# EAGLE design FlipDotModule (EAGLE 9.1.3)
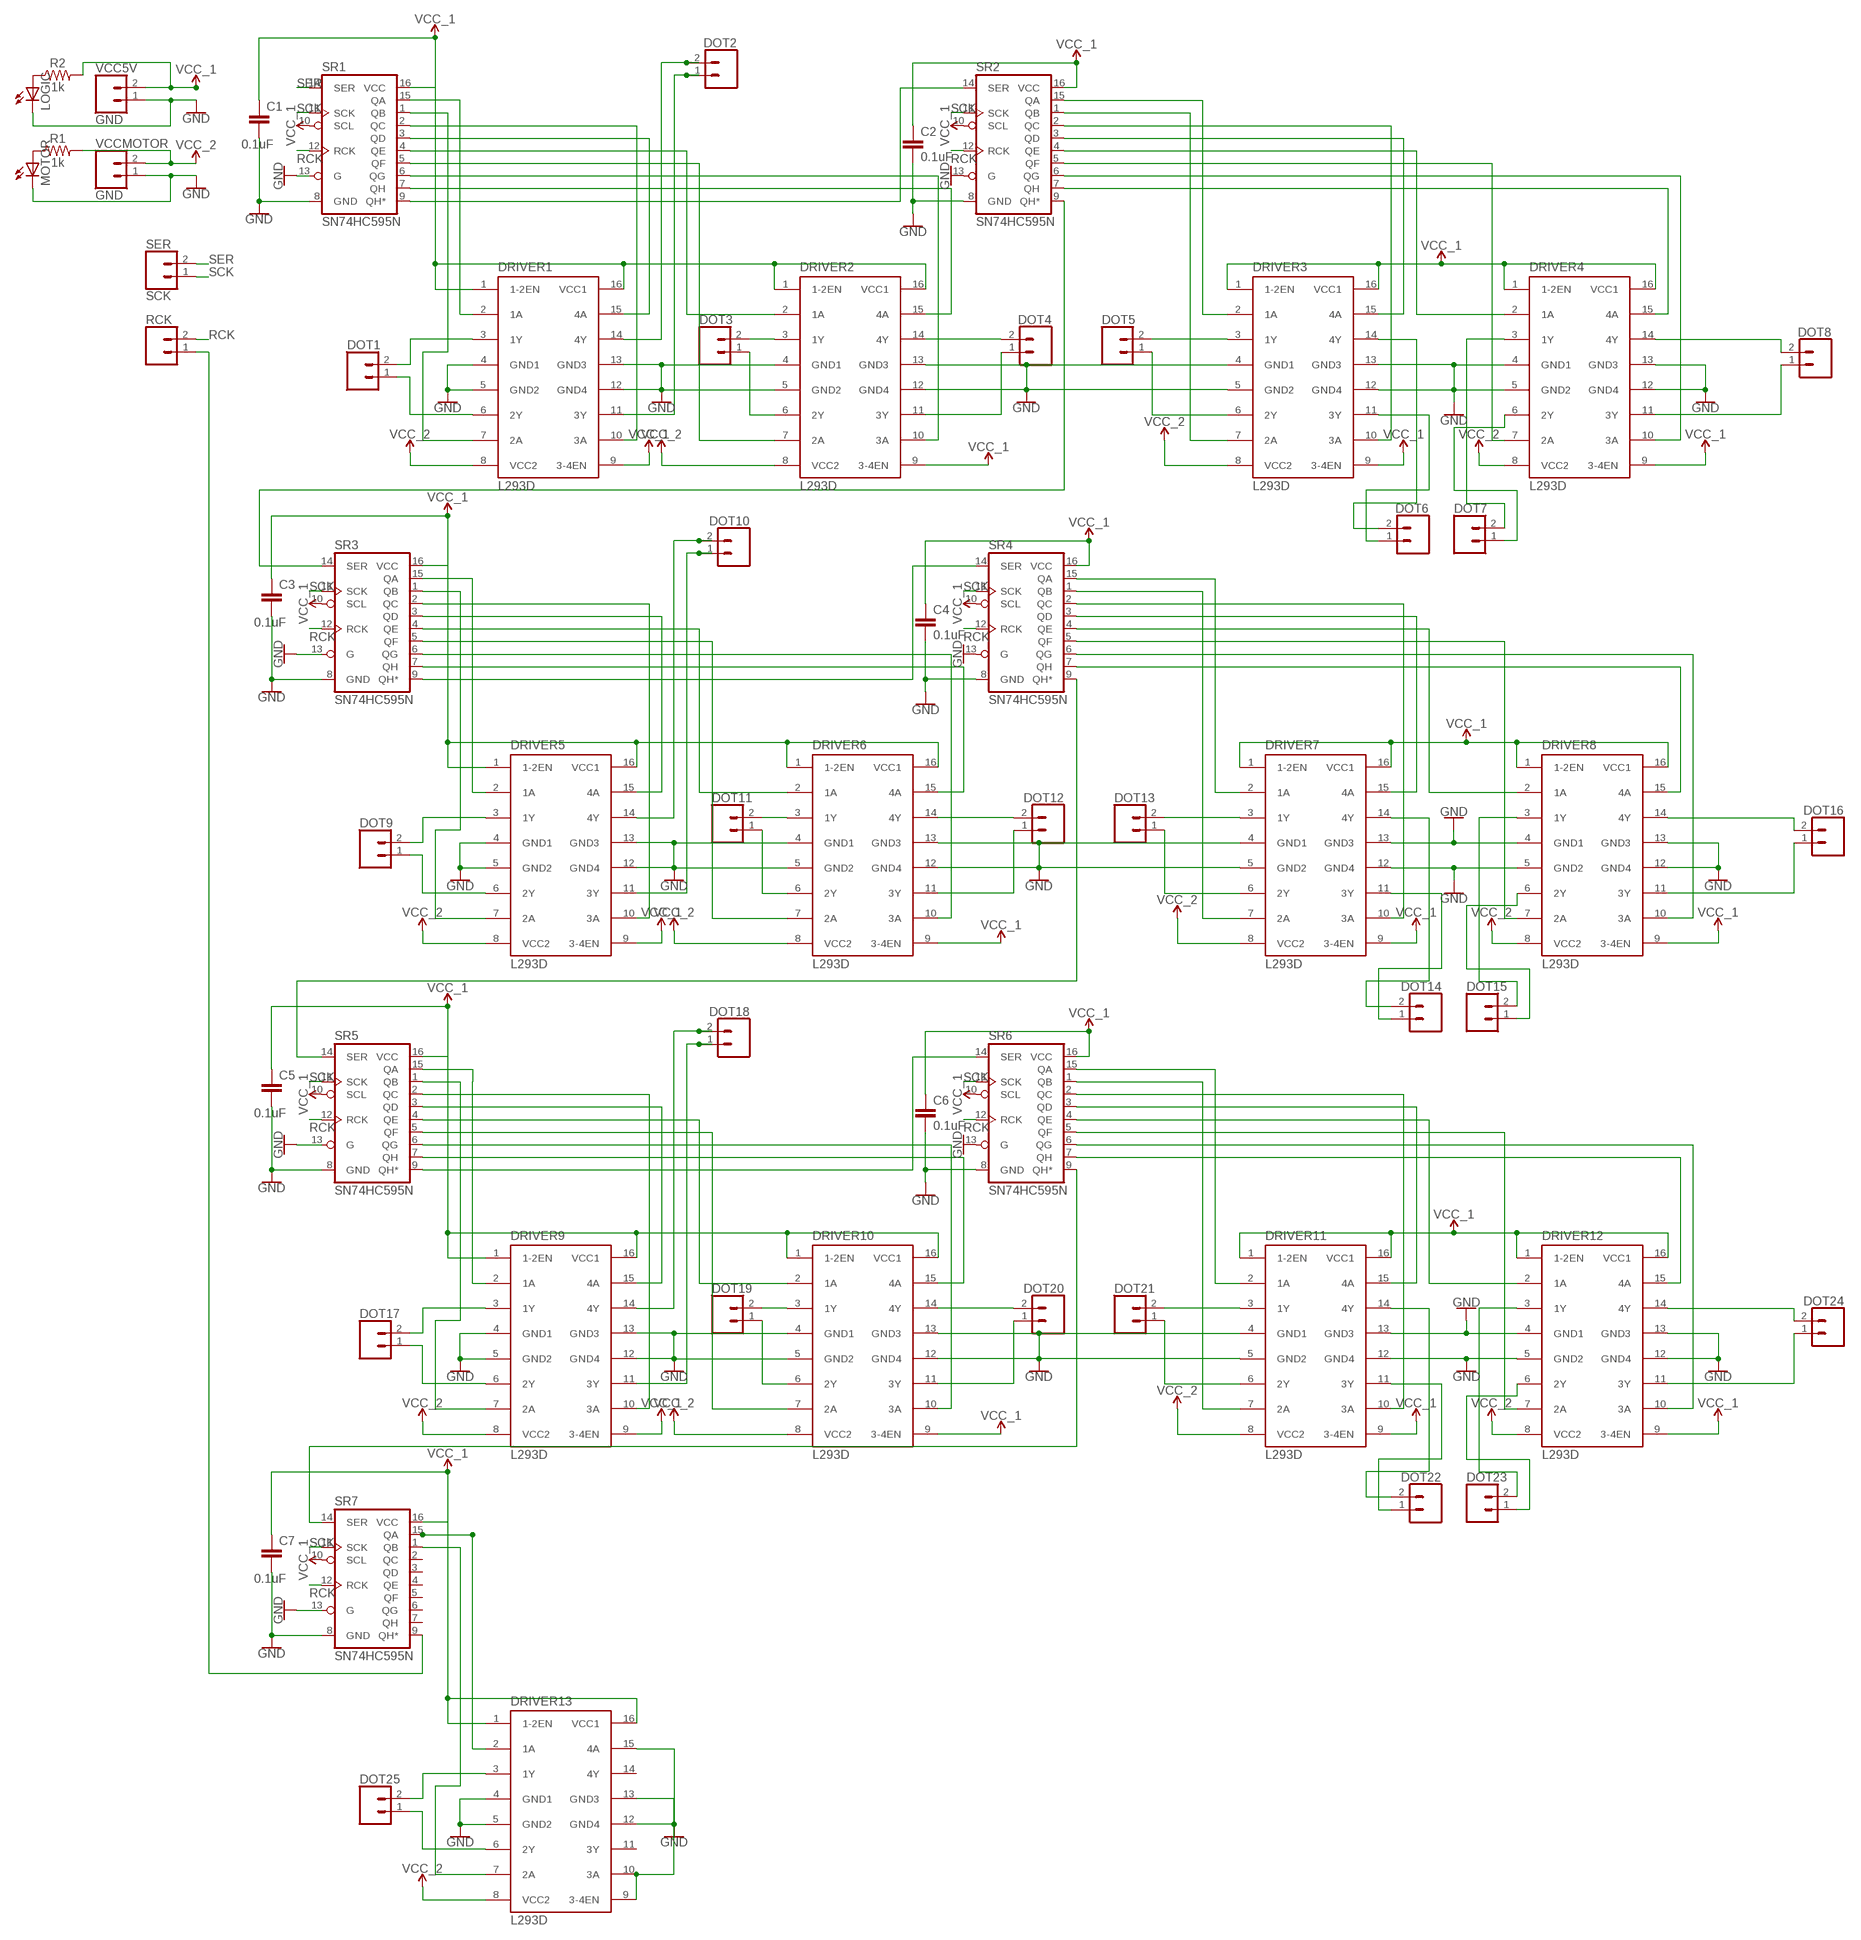
[diagram p0: schematic, sheet 1, part 1 of 2]
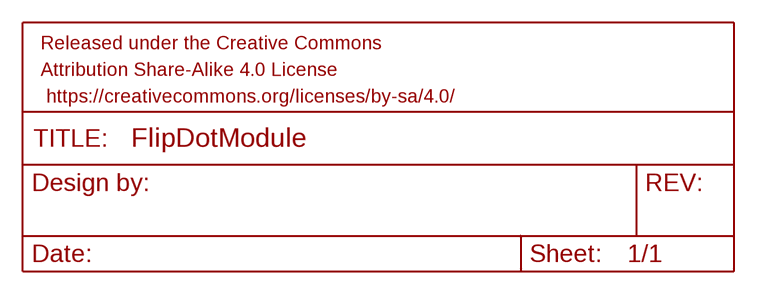
[diagram p1: schematic, sheet 1, part 2 of 2]

## Parts
C1  0.1uF  0.1UF-KIT-EZ-50V-20%  [CAP-PTH-SMALL-KIT]
C2  0.1uF  0.1UF-KIT-EZ-50V-20%  [CAP-PTH-SMALL-KIT]
C3  0.1uF  0.1UF-KIT-EZ-50V-20%  [CAP-PTH-SMALL-KIT]
C4  0.1uF  0.1UF-KIT-EZ-50V-20%  [CAP-PTH-SMALL-KIT]
C5  0.1uF  0.1UF-KIT-EZ-50V-20%  [CAP-PTH-SMALL-KIT]
C6  0.1uF  0.1UF-KIT-EZ-50V-20%  [CAP-PTH-SMALL-KIT]
C7  0.1uF  0.1UF-KIT-EZ-50V-20%  [CAP-PTH-SMALL-KIT]
DOT1  CONN_025MM  [SCREWTERMINAL-5MM-2]
DOT2  CONN_025MM  [SCREWTERMINAL-5MM-2]
DOT3  CONN_025MM  [SCREWTERMINAL-5MM-2]
DOT4  CONN_025MM  [SCREWTERMINAL-5MM-2]
DOT5  CONN_025MM  [SCREWTERMINAL-5MM-2]
DOT6  CONN_025MM  [SCREWTERMINAL-5MM-2]
DOT7  CONN_025MM  [SCREWTERMINAL-5MM-2]
DOT8  CONN_025MM  [SCREWTERMINAL-5MM-2]
DOT9  CONN_025MM  [SCREWTERMINAL-5MM-2]
DOT10  CONN_025MM  [SCREWTERMINAL-5MM-2]
DOT11  CONN_025MM  [SCREWTERMINAL-5MM-2]
DOT12  CONN_025MM  [SCREWTERMINAL-5MM-2]
DOT13  CONN_025MM  [SCREWTERMINAL-5MM-2]
DOT14  CONN_025MM  [SCREWTERMINAL-5MM-2]
DOT15  CONN_025MM  [SCREWTERMINAL-5MM-2]
DOT16  CONN_025MM  [SCREWTERMINAL-5MM-2]
DOT17  CONN_025MM  [SCREWTERMINAL-5MM-2]
DOT18  CONN_025MM  [SCREWTERMINAL-5MM-2]
DOT19  CONN_025MM  [SCREWTERMINAL-5MM-2]
DOT20  CONN_025MM  [SCREWTERMINAL-5MM-2]
DOT21  CONN_025MM  [SCREWTERMINAL-5MM-2]
DOT22  CONN_025MM  [SCREWTERMINAL-5MM-2]
DOT23  CONN_025MM  [SCREWTERMINAL-5MM-2]
DOT24  CONN_025MM  [SCREWTERMINAL-5MM-2]
DOT25  CONN_025MM  [SCREWTERMINAL-5MM-2]
DRIVER1  L293D  [DIL16]
DRIVER2  L293D  [DIL16]
DRIVER3  L293D  [DIL16]
DRIVER4  L293D  [DIL16]
DRIVER5  L293D  [DIL16]
DRIVER6  L293D  [DIL16]
DRIVER7  L293D  [DIL16]
DRIVER8  L293D  [DIL16]
DRIVER9  L293D  [DIL16]
DRIVER10  L293D  [DIL16]
DRIVER11  L293D  [DIL16]
DRIVER12  L293D  [DIL16]
DRIVER13  L293D  [DIL16]
FRAME1  FRAME-LETTERNO_PACKAGE  [DUMMY]
LOGIC  LED3MM  [LED3MM]
MOTOR  LED3MM  [LED3MM]
R1  1k  1KOHM-HORIZ-1/4W-5%  [AXIAL-0.3]
R2  1k  1KOHM-HORIZ-1/4W-5%  [AXIAL-0.3]
RCK  CONN_025MM  [SCREWTERMINAL-5MM-2]
SER  SCK  CONN_025MM  [SCREWTERMINAL-5MM-2]
SR1  SN74HC595N  74HC595N  [DIP16]
SR2  SN74HC595N  74HC595N  [DIP16]
SR3  SN74HC595N  74HC595N  [DIP16]
SR4  SN74HC595N  74HC595N  [DIP16]
SR5  SN74HC595N  74HC595N  [DIP16]
SR6  SN74HC595N  74HC595N  [DIP16]
SR7  SN74HC595N  74HC595N  [DIP16]
VCC5V  GND  CONN_025MM  [SCREWTERMINAL-5MM-2]
VCCMOTOR  GND  CONN_025MM  [SCREWTERMINAL-5MM-2]

## Nets
GND [GND]: C1.2 C2.2 C3.2 C4.2 C5.2 C6.2 C7.2 DRIVER1.4(GND1) DRIVER1.5(GND2) DRIVER1.12(GND4) DRIVER1.13(GND3) DRIVER2.4(GND1) DRIVER2.5(GND2) DRIVER2.12(GND4) DRIVER2.13(GND3) DRIVER3.4(GND1) DRIVER3.5(GND2) DRIVER3.12(GND4) DRIVER3.13(GND3) DRIVER4.4(GND1) DRIVER4.5(GND2) DRIVER4.12(GND4) DRIVER4.13(GND3) DRIVER5.4(GND1) DRIVER5.5(GND2) DRIVER5.12(GND4) DRIVER5.13(GND3) DRIVER6.4(GND1) DRIVER6.5(GND2) DRIVER6.12(GND4) DRIVER6.13(GND3) DRIVER7.4(GND1) DRIVER7.5(GND2) DRIVER7.12(GND4) DRIVER7.13(GND3) DRIVER8.4(GND1) DRIVER8.5(GND2) DRIVER8.12(GND4) DRIVER8.13(GND3) DRIVER9.4(GND1) DRIVER9.5(GND2) DRIVER9.12(GND4) DRIVER9.13(GND3) DRIVER10.4(GND1) DRIVER10.5(GND2) DRIVER10.12(GND4) DRIVER10.13(GND3) DRIVER11.4(GND1) DRIVER11.5(GND2) DRIVER11.12(GND4) DRIVER11.13(GND3) DRIVER12.4(GND1) DRIVER12.5(GND2) DRIVER12.12(GND4) DRIVER12.13(GND3) DRIVER13.4(GND1) DRIVER13.5(GND2) DRIVER13.9(3-4EN) DRIVER13.10(3A) DRIVER13.12(GND4) DRIVER13.13(GND3) DRIVER13.15(4A) LOGIC.K(C) MOTOR.K(C) SR1.8(GND) SR1.13(G) SR2.8(GND) SR2.13(G) SR3.8(GND) SR3.13(G) SR4.8(GND) SR4.13(G) SR5.8(GND) SR5.13(G) SR6.8(GND) SR6.13(G) SR7.8(GND) SR7.13(G) VCC5V.1 VCCMOTOR.1
N$1: SR1.9(QH*) SR2.14(SER)
N$2: DOT5.2 DRIVER3.3(1Y)
N$3: MOTOR.A R1.P$1
N$5: DRIVER1.7(2A) SR1.1(QB)
N$6: SR3.9(QH*) SR4.14(SER)
N$7: LOGIC.A R2.P$1
N$8: DRIVER1.10(3A) SR1.2(QC)
N$9: DRIVER1.15(4A) SR1.3(QD)
N$10: DRIVER2.2(1A) SR1.4(QE)
N$11: DRIVER2.7(2A) SR1.5(QF)
N$12: DRIVER2.10(3A) SR1.6(QG)
N$13: DRIVER2.15(4A) SR1.7(QH)
N$14: DRIVER1.2(1A) SR1.15(QA)
N$16: DRIVER5.7(2A) SR3.1(QB)
N$18: DRIVER3.2(1A) SR2.15(QA)
N$19: DRIVER3.7(2A) SR2.1(QB)
N$20: DRIVER3.10(3A) SR2.2(QC)
N$21: DRIVER3.15(4A) SR2.3(QD)
N$22: DRIVER4.2(1A) SR2.4(QE)
N$23: DRIVER4.7(2A) SR2.5(QF)
N$24: DRIVER4.10(3A) SR2.6(QG)
N$25: DRIVER4.15(4A) SR2.7(QH)
N$26: DOT1.2 DRIVER1.3(1Y)
N$27: DOT4.2 DRIVER2.14(4Y)
N$28: DOT2.1 DRIVER1.11(3Y)
N$29: DOT1.1 DRIVER1.6(2Y)
N$30: DOT3.2 DRIVER2.3(1Y)
N$31: DOT3.1 DRIVER2.6(2Y)
N$32: DOT2.2 DRIVER1.14(4Y)
N$33: DOT4.1 DRIVER2.11(3Y)
N$34: DOT5.1 DRIVER3.6(2Y)
N$35: DOT6.2 DRIVER3.14(4Y)
N$36: DOT6.1 DRIVER3.11(3Y)
N$37: DOT7.2 DRIVER4.3(1Y)
N$38: DOT7.1 DRIVER4.6(2Y)
N$39: DOT8.2 DRIVER4.14(4Y)
N$40: DOT8.1 DRIVER4.11(3Y)
N$41: DRIVER5.10(3A) SR3.2(QC)
N$42: DRIVER5.15(4A) SR3.3(QD)
N$43: DRIVER6.2(1A) SR3.4(QE)
N$44: DRIVER6.7(2A) SR3.5(QF)
N$45: DRIVER6.10(3A) SR3.6(QG)
N$46: DRIVER6.15(4A) SR3.7(QH)
N$47: DRIVER5.2(1A) SR3.15(QA)
N$49: DRIVER7.2(1A) SR4.15(QA)
N$50: DRIVER7.7(2A) SR4.1(QB)
N$51: DRIVER7.10(3A) SR4.2(QC)
N$52: DRIVER7.15(4A) SR4.3(QD)
N$53: DRIVER8.2(1A) SR4.4(QE)
N$54: DRIVER8.7(2A) SR4.5(QF)
N$55: DRIVER8.10(3A) SR4.6(QG)
N$56: DRIVER8.15(4A) SR4.7(QH)
N$57: DOT10.1 DRIVER5.11(3Y)
N$58: DOT9.2 DRIVER5.3(1Y)
N$59: DOT9.1 DRIVER5.6(2Y)
N$60: DOT11.2 DRIVER6.3(1Y)
N$61: DOT11.1 DRIVER6.6(2Y)
N$62: DOT10.2 DRIVER5.14(4Y)
N$63: DOT12.2 DRIVER6.14(4Y)
N$64: DOT12.1 DRIVER6.11(3Y)
N$65: DOT13.2 DRIVER7.3(1Y)
N$66: DOT13.1 DRIVER7.6(2Y)
N$67: DOT14.2 DRIVER7.14(4Y)
N$68: DOT14.1 DRIVER7.11(3Y)
N$69: DOT15.2 DRIVER8.3(1Y)
N$70: DOT15.1 DRIVER8.6(2Y)
N$71: DOT16.2 DRIVER8.14(4Y)
N$72: DOT16.1 DRIVER8.11(3Y)
N$73: SR5.9(QH*) SR6.14(SER)
N$75: DRIVER9.2(1A) SR5.15(QA)
N$76: DRIVER9.7(2A) SR5.1(QB)
N$77: DRIVER9.10(3A) SR5.2(QC)
N$78: DRIVER9.15(4A) SR5.3(QD)
N$79: DRIVER10.2(1A) SR5.4(QE)
N$80: DRIVER10.7(2A) SR5.5(QF)
N$81: DRIVER10.10(3A) SR5.6(QG)
N$82: DRIVER10.15(4A) SR5.7(QH)
N$85: DRIVER11.2(1A) SR6.15(QA)
N$86: DRIVER11.7(2A) SR6.1(QB)
N$87: DRIVER11.10(3A) SR6.2(QC)
N$88: DRIVER11.15(4A) SR6.3(QD)
N$89: DRIVER12.2(1A) SR6.4(QE)
N$90: DRIVER12.7(2A) SR6.5(QF)
N$91: DRIVER12.10(3A) SR6.6(QG)
N$92: DRIVER12.15(4A) SR6.7(QH)
N$93: DOT18.1 DRIVER9.11(3Y)
N$94: DOT17.2 DRIVER9.3(1Y)
N$95: DOT17.1 DRIVER9.6(2Y)
N$96: DOT19.2 DRIVER10.3(1Y)
N$97: DOT19.1 DRIVER10.6(2Y)
N$98: DOT18.2 DRIVER9.14(4Y)
N$99: DOT20.2 DRIVER10.14(4Y)
N$100: DOT20.1 DRIVER10.11(3Y)
N$101: DOT21.2 DRIVER11.3(1Y)
N$102: DOT21.1 DRIVER11.6(2Y)
N$103: DOT22.2 DRIVER11.14(4Y)
N$104: DOT22.1 DRIVER11.11(3Y)
N$105: DOT23.2 DRIVER12.3(1Y)
N$106: DOT23.1 DRIVER12.6(2Y)
N$107: DOT24.2 DRIVER12.14(4Y)
N$108: DOT24.1 DRIVER12.11(3Y)
N$109: RCK.1 SR7.9(QH*)
N$111: DRIVER13.2(1A) SR7.15(QA)
N$112: DRIVER13.7(2A) SR7.1(QB)
N$130: DOT25.2 DRIVER13.3(1Y)
N$131: DOT25.1 DRIVER13.6(2Y)
N$145: SR2.9(QH*) SR3.14(SER)
N$146: SR4.9(QH*) SR5.14(SER)
N$147: SR6.9(QH*) SR7.14(SER)
RCK: RCK.2 SR1.12(RCK) SR2.12(RCK) SR3.12(RCK) SR4.12(RCK) SR5.12(RCK) SR6.12(RCK) SR7.12(RCK)
SCK: SER.1 SR1.11(SCK) SR2.11(SCK) SR3.11(SCK) SR4.11(SCK) SR5.11(SCK) SR6.11(SCK) SR7.11(SCK)
SER: SER.2 SR1.14(SER)
VCC_1 [GND]: C1.1 C2.1 C3.1 C4.1 C5.1 C6.1 C7.1 DRIVER1.1(1-2EN) DRIVER1.9(3-4EN) DRIVER1.16(VCC1) DRIVER2.1(1-2EN) DRIVER2.9(3-4EN) DRIVER2.16(VCC1) DRIVER3.1(1-2EN) DRIVER3.9(3-4EN) DRIVER3.16(VCC1) DRIVER4.1(1-2EN) DRIVER4.9(3-4EN) DRIVER4.16(VCC1) DRIVER5.1(1-2EN) DRIVER5.9(3-4EN) DRIVER5.16(VCC1) DRIVER6.1(1-2EN) DRIVER6.9(3-4EN) DRIVER6.16(VCC1) DRIVER7.1(1-2EN) DRIVER7.9(3-4EN) DRIVER7.16(VCC1) DRIVER8.1(1-2EN) DRIVER8.9(3-4EN) DRIVER8.16(VCC1) DRIVER9.1(1-2EN) DRIVER9.9(3-4EN) DRIVER9.16(VCC1) DRIVER10.1(1-2EN) DRIVER10.9(3-4EN) DRIVER10.16(VCC1) DRIVER11.1(1-2EN) DRIVER11.9(3-4EN) DRIVER11.16(VCC1) DRIVER12.1(1-2EN) DRIVER12.9(3-4EN) DRIVER12.16(VCC1) DRIVER13.1(1-2EN) DRIVER13.16(VCC1) R2.P$2 SR1.10(SCL) SR1.16(VCC) SR2.10(SCL) SR2.16(VCC) SR3.10(SCL) SR3.16(VCC) SR4.10(SCL) SR4.16(VCC) SR5.10(SCL) SR5.16(VCC) SR6.10(SCL) SR6.16(VCC) SR7.10(SCL) SR7.16(VCC) VCC5V.2
VCC_2 [VCC_2]: DRIVER1.8(VCC2) DRIVER2.8(VCC2) DRIVER3.8(VCC2) DRIVER4.8(VCC2) DRIVER5.8(VCC2) DRIVER6.8(VCC2) DRIVER7.8(VCC2) DRIVER8.8(VCC2) DRIVER9.8(VCC2) DRIVER10.8(VCC2) DRIVER11.8(VCC2) DRIVER12.8(VCC2) DRIVER13.8(VCC2) R1.P$2 VCCMOTOR.2
Unconnected: DRIVER13.11(3Y) DRIVER13.14(4Y) SR7.2(QC) SR7.3(QD) SR7.4(QE) SR7.5(QF) SR7.6(QG) SR7.7(QH)

## Library data of the parts
C1-C7 = SparkFun-Capacitors:0.1UF: 0.1µF ceramic capacitors A capacitor is a passive two-terminal electrical component used to store electrical energy temporarily in an electric field.; PROD_ID: CAP-08370
DOT1-DOT25 RCK SER VCC5V VCCMOTOR = SparkFun-Connectors:CONN_02: Multi connection point. Often used as Generic Header-pin footprint for 0.1 inch spaced/style header connections On any of the 0.1 inch spaced packages, you can populate with these: Break Away Headers - Straight <https://www.sparkfun.com/products/116> (PRT-00116) Break Away Male Headers - Right Angle <https://www.sparkfun.com/products/553> (PRT-00553) Female Headers <https://www.sparkfun.com/products/115> (PRT-00115) Break Away Headers - Machine Pin <https://www.sparkfun.com/products/117> (PRT-00117) Break Away Female Headers - Swiss Machine Pin <https://www.sparkfun.com/products/743> (PRT-00743) For SCREWTERMINALS and SPRING TERMINALS visit here: Screw Terimnals on SparkFun.com <https://www.sparkfun.com/search/results?term=Screw+Terminals> (5mm/3.5mm/2.54mm spacing) This device is also useful as a general connection point to wire up your design to another part of your project. Our various solder wires solder well into these plated through hole pads. Hook-Up Wire - Assortment (Stranded, 22 AWG) <https://www.sparkfun.com/products/11375> (PRT-11375) Hook-Up Wire - Assortment (Solid Core, 22 AWG) <https://www.sparkfun.com/products/11367> (PRT-11367) View the entire wire category on our website here <https://www.sparkfun.com/categories/141> Special notes: Molex polarized connector foot print use with: PRT-08233 with associated crimp pins and housings. 2.54_SCREWTERM for use with PRT-10571. 3.5mm Screw Terminal footprints for PRT-08084 5mm Screw Terminal footprints for use with PRT-08432; SF_SKU: PRT-08432
DRIVER1-DRIVER13 = st-microelectronics:L293D: PUSH-PULL 4 CHANNEL DRIVER; MPN: L293D; OC_FARNELL: 9589619; OC_NEWARK: 56P8249
FRAME1 = SparkFun-Aesthetics:FRAME-LETTER: Schematic Frame - Letter Standard 8.5x11 US Letter frame; DESIGNER: Nobody; VERSION: v01
LOGIC MOTOR = led:LED: LED OSRAM: - CHIPLED LG R971, LG N971, LY N971, LG Q971, LY Q971, LO R971, LY R971 LH N974, LH R974 LS Q976, LO Q976, LY Q976 LO Q996 - Hyper CHIPLED LW Q18S LB Q993, LB Q99A, LB R99A - SideLED LS A670, LO A670, LY A670, LG A670, LP A670 LB A673, LV A673, LT A673, LW A673 LH A674 LY A675 LS A676, LA A676, LO A676, LY A676, LW A676 LS A679, LY A679, LG A679 - Hyper Micro SIDELED® LS Y876, LA Y876, LO Y876, LY Y876 LT Y87S - SmartLED LW L88C, LW L88S LB L89C, LB L89S, LG L890 LS L89K, LO L89K, LY L89K LS L896, LA L896, LO L896, LY L896 - TOPLED LS T670, LO T670, LY T670, LG T670, LP T670 LSG T670, LSP T670, LSY T670, LOP T670, LYG T670 LG T671, LOG T671, LSG T671 LB T673, LV T673, LT T673, LW T673 LH T674 LS T676, LA T676, LO T676, LY T676, LB T676, LH T676, LSB T676, LW T676 LB T67C, LV T67C, LT T67C, LS T67K, LO T67K, LY T67K, LW E67C LS E67B, LA E67B, LO E67B, LY E67B, LB E67C, LV E67C, LT E67C LW T67C LS T679, LY T679, LG T679 LS T770, LO T770, LY T770, LG T770, LP T770 LB T773, LV T773, LT T773, LW T773 LH T774 LS E675, LA E675, LY E675, LS T675 LS T776, LA T776, LO T776, LY T776, LB T776 LHGB T686 LT T68C, LB T68C - Hyper Mini TOPLED® LB M676 - Mini TOPLED Santana® LG M470 LS M47K, LO M47K, LY M47K Source: http://www.osram.convergy.de LUXEON: - LUMILED® LXK2-PW12-R00, LXK2-PW12-S00, LXK2-PW14-U00, LXK2-PW14-V00 LXK2-PM12-R00, LXK2-PM12-S00, LXK2-PM14-U00 LXK2-PE12-Q00, LXK2-PE12-R00, LXK2-PE12-S00, LXK2-PE14-T00, LXK2-PE14-U00 LXK2-PB12-K00, LXK2-PB12-L00, LXK2-PB12-M00, LXK2-PB14-N00, LXK2-PB14-P00, LXK2-PB14-Q00 LXK2-PR12-L00, LXK2-PR12-M00, LXK2-PR14-Q00, LXK2-PR14-R00 LXK2-PD12-Q00, LXK2-PD12-R00, LXK2-PD12-S00 LXK2-PH12-R00, LXK2-PH12-S00 LXK2-PL12-P00, LXK2-PL12-Q00, LXK2-PL12-R00 Source: www.luxeon.com KINGBRIGHT: KA-3528ASYC Source: www.kingbright.com
R1 R2 = SparkFun-Resistors:1KOHM: 1kΩ resistor A resistor is a passive two-terminal electrical component that implements electrical resistance as a circuit element. Resistors act to reduce current flow, and, at the same time, act to lower voltage levels within circuits. - Wikipedia; PROD_ID: RES-08380
SR1-SR7 = SparkFun-IC-Logic:74*595: 8-Bit Shift Register (Serial to Parallel) Datasheet <http://cdn.sparkfun.com/datasheets/BreakoutBoards/MM74HC595.pdf> SparkFun Products SparkFun Shift Register Breakout - 74HC595 <https://www.sparkfun.com/products/10680> (BOB-10680); PROD_ID: IC-13123

## Net classes
1 GND: width 0.61 mm
2 VCC_2: width 0.61 mm

## Board
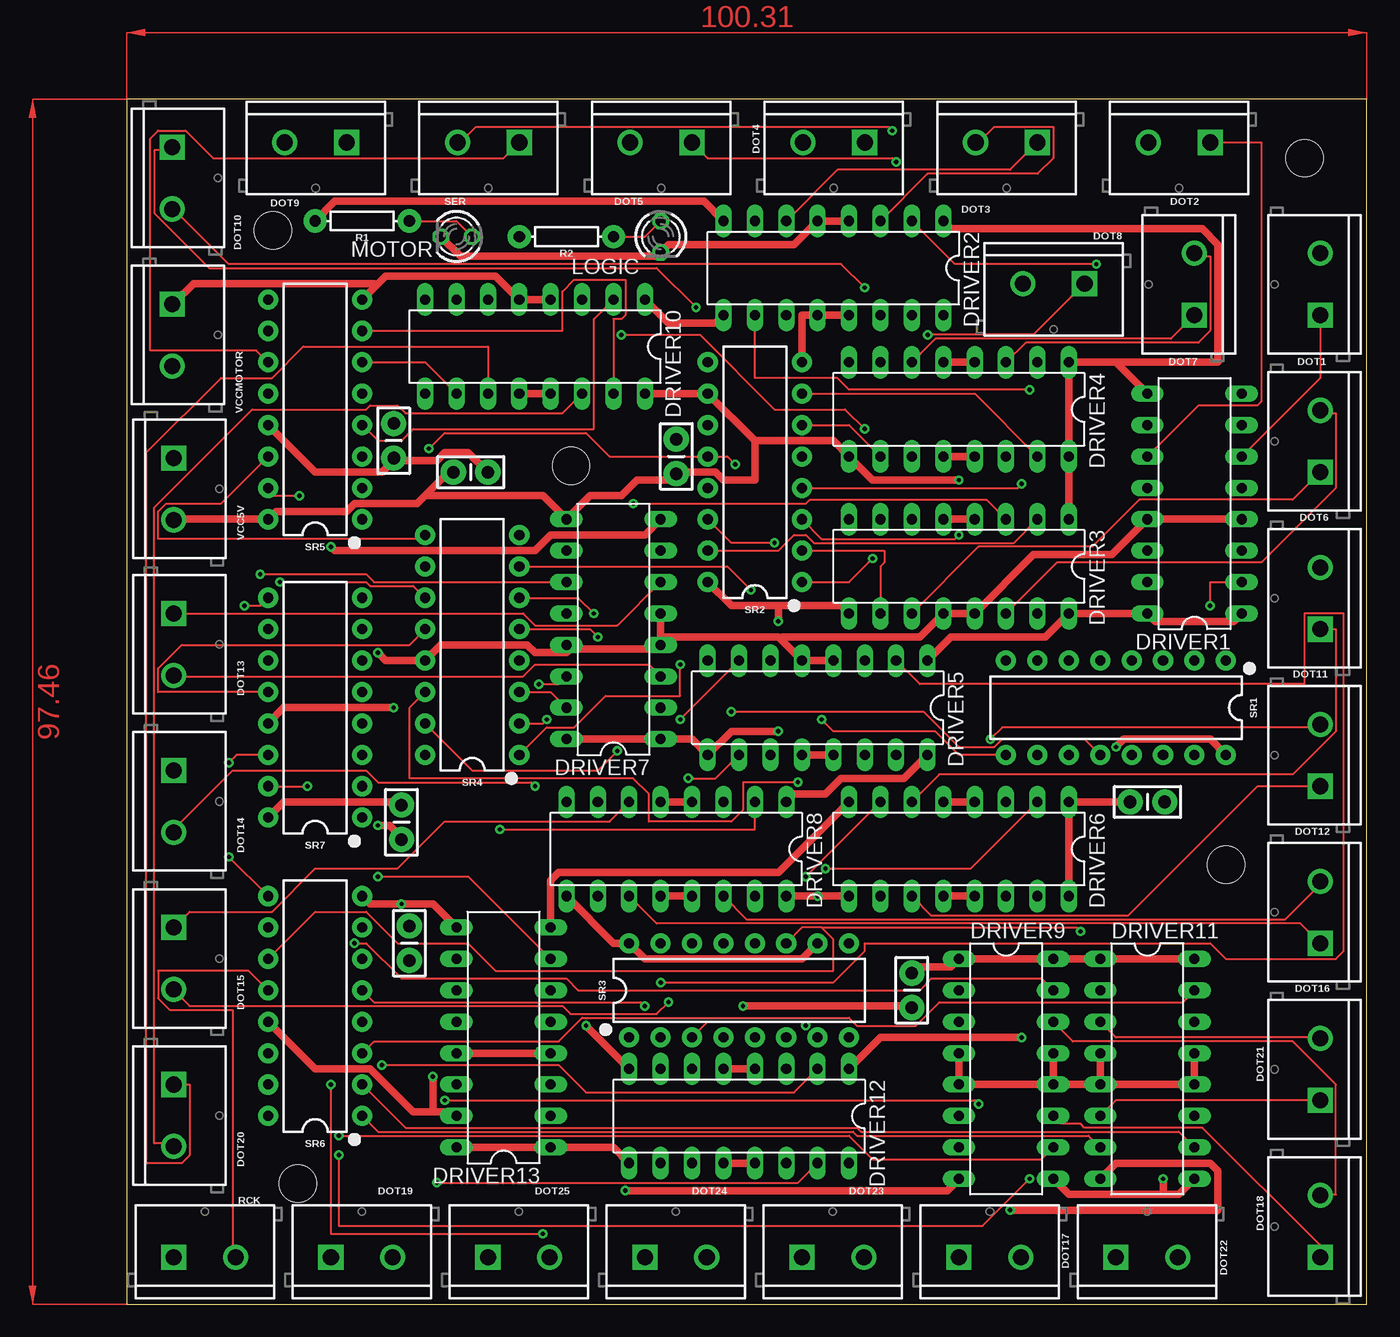
[diagram p2: board, top side]
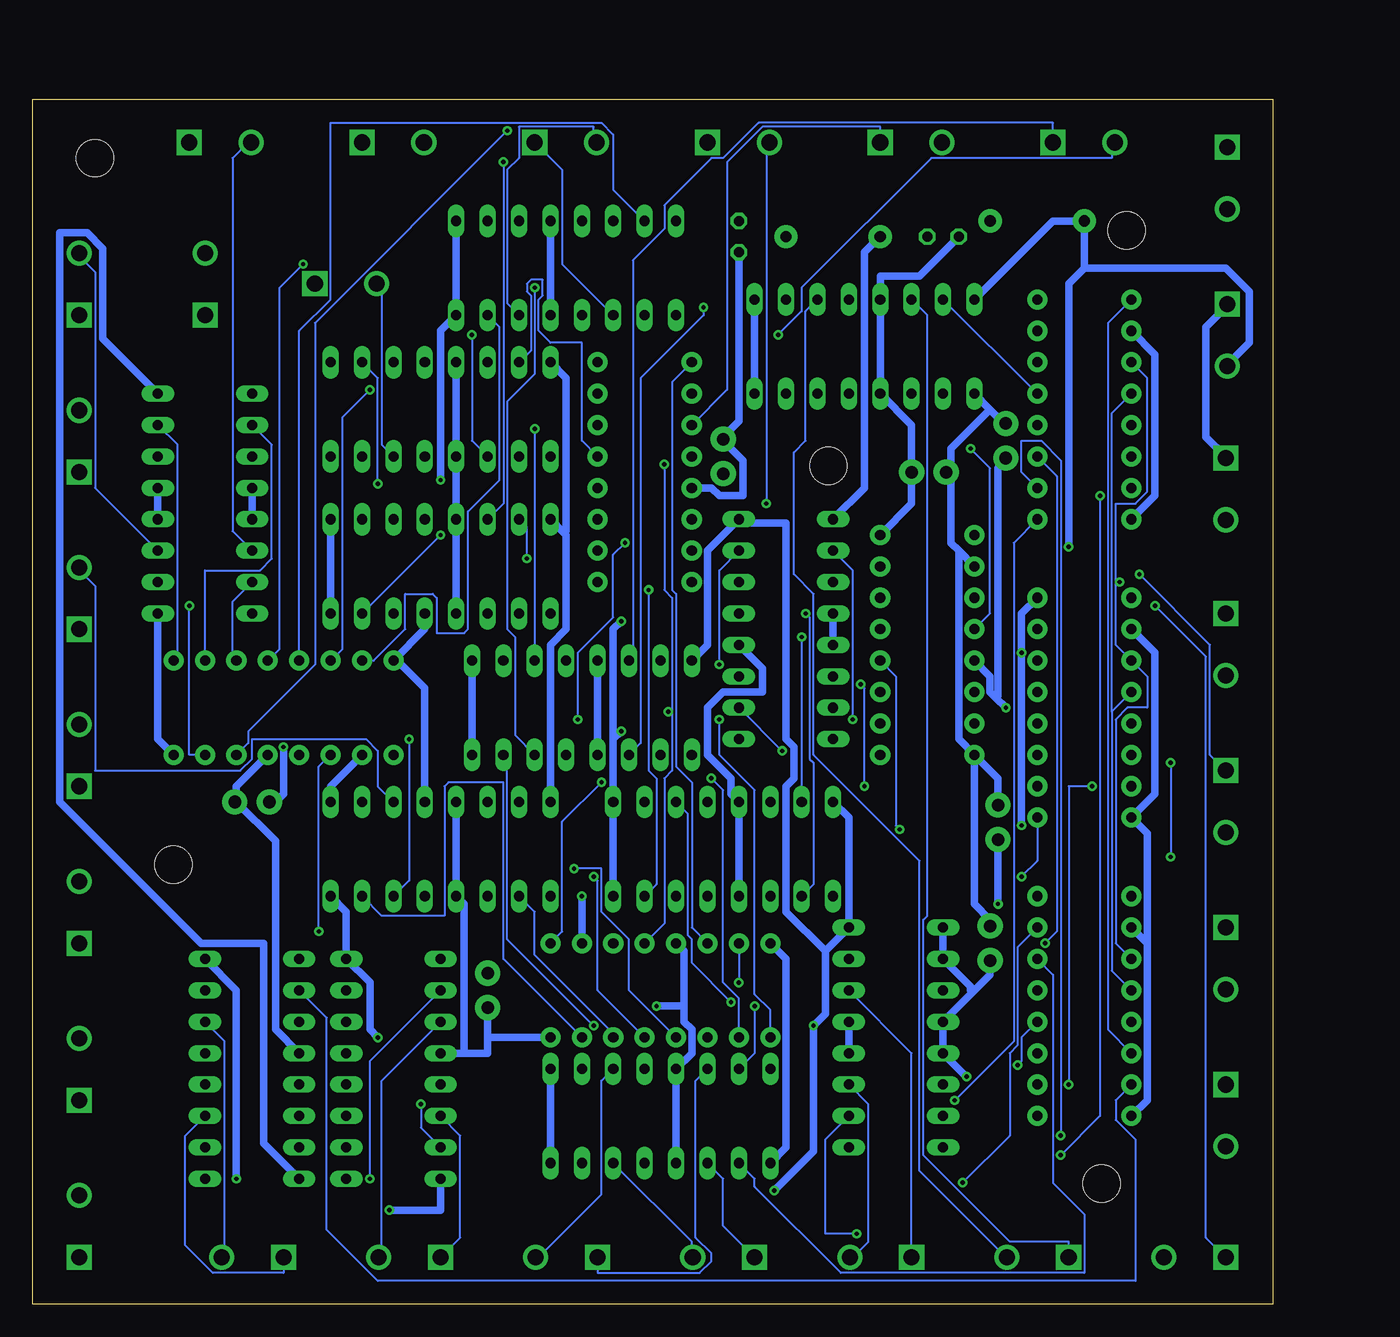
[diagram p3: board, bottom side, seen from below]

Size 100.31 x 97.46 mm. Coordinates in mm from the lower left corner, seen from the top.
Outline: 0,0 100.31,0 100.31,97.46 0,97.46 0,0
Copper layers (1*16): Top 0.035mm / dielectric 1.5mm / Bottom 0.035mm
Design rules "default": minimum track width 6mil, minimum drill 0.35mm, track to track 6mil, track to pad 6mil, pad to pad 6mil, via to via 6mil, smd to smd 6mil, copper to edge 40mil, drill to drill 6mil, minimum pad ring 10mil, minimum via ring 8mil, stop-mask expansion 4mil, vias tented up to drill 0mil, thermal gap 10mil
Holes 3 mm at 11.81,86.87 13.84,9.78 88.9,35.56 95.25,92.71 35.94,67.82

### Footprints (pad centres in the part's own frame; a part is rotated, then mirrored left to right if it is on the bottom)
CAP-PTH-SMALL-KIT = drill 1.016 pad 2.032: 1 -1.397,0; 2 1.397,0
SCREWTERMINAL-5MM-2 = drill 1.3 pad 2.032 square: 1 0,0 | drill 1.3 pad 2.032: 2 5,0
DIL16 = drill 0.813 long: 1 -8.89,-3.81; 2 -6.35,-3.81; 3 -3.81,-3.81; 4 -1.27,-3.81; 5 1.27,-3.81; 6 3.81,-3.81; 7 6.35,-3.81; 8 8.89,-3.81; 9 8.89,3.81; 10 6.35,3.81; 11 3.81,3.81; 12 1.27,3.81; 13 -1.27,3.81; 14 -3.81,3.81; 15 -6.35,3.81; 16 -8.89,3.81
LED3MM = drill 0.813 octagon: A -1.27,0; K 1.27,0
AXIAL-0.3 = drill 0.9 pad 1.88: P$1 -3.81,0; P$2 3.81,0
DIP16 = drill 0.813 pad 1.626: 1 -8.89,-3.81; 2 -6.35,-3.81; 3 -3.81,-3.81; 4 -1.27,-3.81; 5 1.27,-3.81; 6 3.81,-3.81; 7 6.35,-3.81; 8 8.89,-3.81; 9 8.89,3.81; 10 6.35,3.81; 11 3.81,3.81; 12 1.27,3.81; 13 -1.27,3.81; 14 -3.81,3.81; 15 -6.35,3.81; 16 -8.89,3.81

### Placement (x,y rotation side)
C1  82.55,40.64 0 top
C2  44.45,68.58 90 top
C3  63.5,25.4 270 top
C4  27.81,67.31 0 top
C5  21.59,69.85 270 top
C6  22.86,29.21 270 top
C7  22.23,38.99 270 top
DOT1  96.52,80.01 90 top
DOT2  87.63,93.98 180 top
DOT3  73.66,93.98 180 top
DOT4  59.69,93.98 180 top
DOT5  45.72,93.98 180 top
DOT6  96.52,67.31 90 top
DOT7  86.36,80.01 90 top
DOT8  77.47,82.55 180 top
DOT9  17.78,93.98 180 top
DOT10  3.68,93.6 270 top
DOT11  96.52,54.61 90 top
DOT12  96.52,41.91 90 top
DOT13  3.81,55.88 270 top
DOT14  3.81,43.18 270 top
DOT15  3.81,30.48 270 top
DOT16  96.52,29.21 90 top
DOT17  67.31,3.81 0 top
DOT18  96.52,3.81 90 top
DOT19  16.51,3.81 0 top
DOT20  3.81,17.78 270 top
DOT21  96.52,16.51 90 top
DOT22  80.01,3.81 0 top
DOT23  54.61,3.81 0 top
DOT24  41.91,3.81 0 top
DOT25  29.21,3.81 0 top
DRIVER1  86.36,64.77 90 top
DRIVER2  57.15,83.82 180 top
DRIVER3  67.31,59.69 180 top
DRIVER4  67.31,72.39 180 top
DRIVER5  55.88,48.26 180 top
DRIVER6  67.31,36.83 180 top
DRIVER7  39.37,54.61 90 top
DRIVER8  44.45,36.83 180 top
DRIVER9  71.12,19.05 270 top
DRIVER10  33.02,77.47 180 top
DRIVER11  82.55,19.05 270 top
DRIVER12  49.53,15.24 180 top
DRIVER13  30.48,21.59 90 top
FRAME1  -5.08,110.49 0 top  (outside the outline)
LOGIC  43.18,86.36 270 top
MOTOR  26.67,86.36 180 top
R1  19.05,87.63 180 top
R2  35.56,86.36 180 top
RCK  3.81,3.81 0 top
SER  31.75,93.98 180 top
SR1  80.01,48.26 180 top
SR2  50.8,67.31 90 top
SR3  49.53,25.4 0 top
SR4  27.94,53.34 90 top
SR5  15.24,72.39 90 top
SR6  15.24,24.13 90 top
SR7  15.24,48.26 90 top
VCC5V  3.81,68.45 270 top
VCCMOTOR  3.68,80.9 270 top

### Tracks (layer width: path | path; a pad name or v marks a point on that pad's centre or on a via)
GND  (via drill 0.35)
  Top 0.61: DRIVER1.4 DRIVER1.13 79.69,60.64 73.34,60.64 DRIVER3.13 DRIVER3.12 64.14,53.97 53.02,53.97 52.86,53.82 | DRIVER3.4 DRIVER3.5 | DRIVER4.13 DRIVER4.12 | DRIVER9.13 DRIVER9.12 | DRIVER11.4 DRIVER11.5 | DRIVER11.5 DRIVER9.12 | DRIVER12.13 DRIVER12.12 | DRIVER6.13 DRIVER6.12 | DRIVER6.4 DRIVER6.5 | DRIVER9.4 DRIVER9.5 DRIVER9.12 | v49.85,24.13 63.5,24.13 C3.2 | DRIVER2.13 DRIVER2.12 54.61,80.01 SR2.8 | DRIVER2.4 DRIVER2.5 53.98,85.73 43.82,85.73 LOGIC.K 42.86,84.77 26.99,84.77 MOTOR.K | SR5.13 15.24,67.31 20.64,67.31 21.59,68.26 | 21.59,68.26 C5.2 21.59,68.26 | DRIVER10.13 DRIVER10.12 | 21.59,68.26 25.08,68.26 25.72,68.9 27.62,68.9 C4.2 | DRIVER10.4 DRIVER10.5 29.84,83.19 20.95,83.19 20.16,82.39 | 20.16,82.39 SR5.8 | VCCMOTOR.1 3.81,80.96 5.4,82.55 20,82.55 20.16,82.39 | DRIVER13.15 26.35,15.56 24.77,15.56 | 24.77,15.56 23.18,15.56 19.69,19.05 15.24,19.05 SR6.13 | SR6.8 19.69,32.38 v22.23,32.38 24.77,32.38 DRIVER13.9 | DRIVER13.13 DRIVER13.4 | v24.77,18.41 24.77,15.56 | DRIVER5.13 DRIVER5.12 | DRIVER5.4 DRIVER5.5 52.86,53.82 | DRIVER8.13 DRIVER8.12 | DRIVER7.5 43.18,53.97 | 43.18,53.97 DRIVER7.4 | 35.88,53.02 42.86,53.02 DRIVER7.4 | SR7.13 12.7,48.26 v21.59,48.26 | v20.32,52.7 20.95,52.07 SR4.13 25.4,53.34 32.39,53.34 33.02,52.7 35.56,52.7 35.88,53.02 | 52.86,53.82 52.7,53.97 43.18,53.97 | 43.18,53.97 DRIVER7.4 | v20.32,38.73 21.27,38.73 22.23,37.78 C7.2 | 35.88,53.02 DRIVER7.13 35.88,53.02 | DRIVER8.5 DRIVER8.4 | DRIVER4.5 DRIVER4.4 | DRIVER11.13 DRIVER11.12 DRIVER11.5 | DRIVER12.5 DRIVER12.4
  Bottom 0.61: DRIVER1.12 DRIVER1.13 | DRIVER1.5 DRIVER1.4 | DRIVER4.5 DRIVER4.12 DRIVER3.5 DRIVER3.12 | SR1.13 83.82,41.91 83.82,40.64 | 83.82,40.64 C1.2 83.82,40.64 | 83.82,40.64 80.64,37.46 80.64,22.23 DRIVER11.4 | SR3.13 47.62,28.57 47.62,24.13 | 47.62,24.13 47.62,22.86 46.99,22.23 46.99,20.32 DRIVER12.5 DRIVER12.12 | DRIVER6.5 DRIVER6.12 65.41,32.38 65.41,20.32 | 63.5,21.59 SR3.8 | 63.5,21.59 63.5,23.81 C3.2 | 65.41,20.32 63.5,20.32 63.5,21.59 | 65.41,20.32 DRIVER9.4 | v49.85,24.13 47.62,24.13 | DRIVER6.4 68.58,49.85 70.8,52.07 SR1.8 68.58,54.61 DRIVER3.13 | SR2.13 45.4,66.04 44.77,65.41 42.86,65.41 42.86,68.26 44.45,69.85 C2.2 44.45,70.17 43.18,71.44 LOGIC.K | DRIVER2.4 DRIVER2.13 | SR4.8 29.21,64.77 C4.2 29.21,71.12 DRIVER10.12 DRIVER10.5 31.75,83.19 28.58,83.19 MOTOR.K | VCC5V.1 3.81,68.58 5.4,70.17 5.4,79.06 3.81,80.65 VCCMOTOR.1 | DRIVER13.9 DRIVER13.10 24.45,25.72 24.45,25.4 24.29,25.24 | v22.23,32.38 22.23,37.46 C7.2 | DRIVER13.5 DRIVER13.4 | 24.29,25.24 22.86,26.67 22.86,27.62 C6.2 | 24.29,25.24 DRIVER13.12 DRIVER13.13 v24.77,18.41 | DRIVER5.5 DRIVER5.12 | 22.38,49.05 22.86,49.53 22.86,50.8 SR4.13 | 22.38,49.05 v21.59,48.26 | SR7.8 20.32,55.88 v20.32,52.7 v20.32,38.73 | DRIVER7.4 41.27,51.43 41.27,49.53 44.45,49.53 45.72,48.26 45.72,44.45 43.82,42.54 43.82,41.27 DRIVER8.5 DRIVER8.12 | C5.2 21.59,68.26 22.23,67.63 22.23,49.21 22.38,49.05 | DRIVER7.13 DRIVER7.12
N$1  (via drill 0.35)
  Top 0.152: SR2.14 48.9,61.59 v52.39,61.59 | v56.2,47.31 57.15,46.35 65.41,46.35 67.31,44.45 SR1.9
  Bottom 0.152: v52.39,61.59 53.34,60.64 53.34,55.56 56.2,52.7 v56.2,47.31
N$2  (via drill 0.35)
  Top 0.152: DRIVER3.3 69.53,65.09 55.25,65.09 54.93,64.77 v40.96,64.77
  Bottom 0.152: v40.96,64.77 40.96,93.98 DOT5.2
N$3
  Top 0.152: MOTOR.A 26.67,87.63 R1.P$1
N$5
  Bottom 0.152: DRIVER1.7 88.58,69.53 88.58,52.39 SR1.1
N$6  (via drill 0.35)
  Top 0.152: SR4.14 22.86,48.26 22.86,42.54 40.96,42.54 42.23,41.27 42.23,39.05 48.9,39.05 49.85,40 49.85,42.23 v54.29,42.23
  Bottom 0.152: v54.29,42.23 57.47,39.05 57.47,30.16 SR3.9
N$7
  Top 0.152: LOGIC.A 41.91,86.36 R2.P$1
N$8
  Bottom 0.152: DRIVER1.10 80.96,69.53 80.96,60.32 81.92,59.37 86.36,59.37 SR1.2
N$9
  Bottom 0.152: DRIVER1.15 84.14,56.83 84.14,52.39 SR1.3
N$10  (via drill 0.35)
  Top 0.152: DRIVER2.2 66.99,84.14 v78.42,84.14
  Bottom 0.152: v78.42,84.14 80.33,82.23 80.33,53.02 SR1.4
N$11
  Bottom 0.152: DRIVER2.7 53.34,90.17 53.34,94.62 54.29,95.57 76.2,95.57 76.2,81.28 78.74,78.74 SR1.5
N$12  (via drill 0.35)
  Top 0.152: DRIVER2.10 50.8,74.93 57.47,74.93 58.42,73.98 v73.03,73.98
  Bottom 0.152: v73.03,73.98 75.25,71.76 75.25,53.02 SR1.6
N$13
  Bottom 0.152: DRIVER2.15 62.55,79.06 62.55,66.67 65.09,64.14 65.09,54.61 65.41,54.29 67.63,54.29 67.63,57.15 67.95,57.47 70.17,57.47 70.17,54.61 72.71,52.07 SR1.7
N$14  (via drill 0.35)
  Top 0.152: DRIVER1.2 87.63,58.42 v87.63,56.51
  Bottom 0.152: v87.63,56.51 87.63,44.45 SR1.15
N$16  (via drill 0.35)
  Top 0.152: v44.77,47.31 DRIVER5.7
  Bottom 0.152: v44.77,47.31 44.77,44.45 41.91,41.59 41.91,25.08 40.64,23.81 SR3.1
N$18
  Top 0.152: DRIVER3.2 71.75,61.59 55.56,61.59 54.93,62.23 53.98,62.23 52.7,60.96 SR2.15
N$19  (via drill 0.35)
  Top 0.152: v60.33,60.32 58.42,58.42 SR2.1
  Bottom 0.152: DRIVER3.7 60.33,62.87 v60.33,60.32
N$20
  Top 0.152: DRIVER3.10 60.96,59.69 61.28,60.01 61.28,60.96 SR2.2
N$21  (via drill 0.35)
  Top 0.152: v67.31,62.23 66.99,61.91 56.2,61.91 SR2.3
  Bottom 0.152: v67.31,62.23 DRIVER3.15
N$22  (via drill 0.35)
  Top 0.152: v72.39,66.36 72.07,66.04 SR2.4
  Bottom 0.152: DRIVER4.2 72.39,74.93 v72.39,66.36
N$23
  Bottom 0.152: DRIVER4.7 60.01,77.15 60.01,81.6 60.33,81.92 60.33,82.55 60.01,82.87 59.06,82.87 59.06,81.6 59.37,81.28 59.37,78.74 58.42,77.79 55.88,77.79 55.88,69.85 SR2.5
N$24
  Top 0.152: DRIVER4.10 58.42,71.12 SR2.6
N$25
  Top 0.152: DRIVER4.15 68.58,73.66 SR2.7
N$26
  Bottom 0.152: DRIVER1.3 95.25,66.04 95.25,83.5 96.52,84.77 DOT1.2
N$27
  Bottom 0.152: DRIVER2.14 61.91,80.96 61.91,91.76 60.96,92.71 60.96,95.25 54.93,95.25 54.93,93.98 DOT4.2
N$28
  Top 0.152: DRIVER1.11 86.68,72.71 91.44,72.71 91.76,73.03 91.76,93.98 DOT2.1
N$29
  Top 0.152: DRIVER1.6 96.52,74.93 DOT1.1
N$30
  Top 0.152: DRIVER2.3 64.77,91.44 73.66,91.44 74.93,92.71 74.93,95.25 70.17,95.25 68.9,93.98 DOT3.2
N$31
  Top 0.152: DRIVER2.6 57.47,91.76 71.44,91.76 DOT3.1
N$32
  Bottom 0.152: DRIVER1.14 84.14,62.55 84.14,92.71 82.87,93.98 DOT2.2
N$33
  Bottom 0.152: DRIVER2.11 57.47,84.14 57.47,91.76 DOT4.1
N$34  (via drill 0.35)
  Top 0.152: v62.23,92.39 61.91,92.71 46.99,92.71 DOT5.1
  Bottom 0.152: DRIVER3.6 62.23,64.77 v62.23,92.39
N$35
  Top 0.152: DRIVER3.14 75.25,60.01 91.76,60.01 97.79,66.04 97.79,72.07 96.52,72.07 DOT6.2
N$36
  Top 0.152: DRIVER3.11 68.9,61.28 78.11,61.28 81.92,65.09 94.3,65.09 DOT6.1
N$37
  Top 0.152: DRIVER4.3 72.71,77.79 86.68,77.79 87.63,78.74 87.63,84.77 86.36,84.77 DOT7.2
N$38
  Top 0.152: DRIVER4.6 65.41,78.11 84.45,78.11 DOT7.1
N$39
  Bottom 0.152: DRIVER4.14 72.07,69.53 72.07,82.23 72.39,82.55 DOT8.2
N$40  (via drill 0.35)
  Top 0.152: v64.77,78.42 73.34,78.42 DOT8.1
  Bottom 0.152: DRIVER4.11 64.77,69.85 v64.77,78.42
N$41  (via drill 0.35)
  Top 0.152: DRIVER5.10 47.62,42.54 v45.4,42.54
  Bottom 0.152: v45.4,42.54 44.45,41.59 44.45,26.04 43.18,24.77 SR3.2
N$42  (via drill 0.35)
  Top 0.152: v54.93,22.54 54.61,22.86 46.99,22.86 SR3.3
  Bottom 0.152: DRIVER5.15 61.91,44.13 61.91,29.53 v54.93,22.54
N$43  (via drill 0.35)
  Top 0.152: DRIVER6.2 68.26,35.24 v56.52,35.24
  Bottom 0.152: v56.52,35.24 54.29,35.24 54.29,31.75 52.07,29.53 52.07,25.4 SR3.4
N$44  (via drill 0.35)
  Top 0.152: v54.93,34.61 DRIVER6.7
  Bottom 0.152: v54.93,34.61 54.61,34.29 54.61,25.4 SR3.5
N$45
  Bottom 0.152: DRIVER6.10 59.69,31.75 59.69,28.26 53.34,21.91 SR3.6
N$46
  Bottom 0.152: DRIVER6.15 72.07,31.43 66.99,31.43 66.99,41.91 66.67,42.23 62.23,42.23 62.23,27.94 SR3.7
N$47  (via drill 0.35)
  Top 0.152: DRIVER5.2 64.14,50.16 95.25,50.16 95.25,55.88 98.42,55.88 98.42,28.57 97.79,27.94 88.9,27.94 87.63,29.21 59.69,29.21 59.69,28.57 57.15,26.04 v43.18,26.04
  Bottom 0.152: SR3.15 v43.18,26.04
N$49  (via drill 0.35)
  Top 0.152: v39.69,44.77 38.1,43.18 27.94,43.18 SR4.15
  Bottom 0.152: v39.69,44.77 DRIVER7.2
N$50  (via drill 0.35)
  Top 0.152: v44.77,51.75 44.77,49.21 38.73,49.21 36.2,46.67 33.97,46.67 SR4.1
  Bottom 0.152: DRIVER7.7 44.77,59.37 v44.77,51.75
N$51  (via drill 0.35)
  Top 0.152: v33.97,47.31 33.66,46.99 SR4.2
  Bottom 0.152: DRIVER7.10 33.97,59.37 v33.97,47.31
N$52
  Top 0.152: DRIVER7.15 34.29,49.53 SR4.3
N$53  (via drill 0.35)
  Top 0.152: DRIVER8.2 50.8,38.42 v30.16,38.42
  Bottom 0.152: v30.16,38.42 30.48,38.73 30.48,50.8 SR4.4
N$54  (via drill 0.35)
  Top 0.152: v38.1,53.97 37.47,54.61 SR4.5
  Bottom 0.152: v38.1,53.97 DRIVER8.7
N$55  (via drill 0.35)
  Top 0.152: v37.78,55.88 36.51,57.15 SR4.6
  Bottom 0.152: DRIVER8.10 37.15,33.97 37.15,43.81 37.47,44.13 37.47,55.56 v37.78,55.88
N$56  (via drill 0.35)
  Top 0.152: v50.48,57.78 48.58,59.69 SR4.7
  Bottom 0.152: DRIVER8.15 49.85,33.97 49.85,42.54 50.48,43.18 v50.48,57.78
N$57  (via drill 0.35)
  Top 0.152: v46.04,80.65 42.86,83.82 6.67,83.82 2.22,88.27 2.22,93.34 3.49,93.34 DOT10.1
  Bottom 0.152: DRIVER5.11 51.12,45.4 51.12,74.93 46.04,80.01 v46.04,80.65
N$58  (via drill 0.35)
  Top 0.152: v59.69,70.8 58.1,72.39 52.39,72.39 46.36,78.42 v40.01,78.42
  Bottom 0.152: v59.69,70.8 DRIVER5.3 | v40.01,78.42 38.1,80.33 38.1,82.23 27.62,92.71 13.02,92.71 13.02,93.98 DOT9.2
N$59
  Bottom 0.152: DRIVER5.6 51.75,52.39 51.75,84.45 49.21,87 49.21,88.9 45.4,92.71 44.45,92.71 41.59,95.57 17.78,95.57 DOT9.1
N$60
  Bottom 0.152: DRIVER6.3 72.39,41.91 72.39,44.77 73.34,45.72 82.55,45.72 82.55,44.13 83.5,43.18 95.25,43.18 95.25,58.1 96.52,59.37 DOT11.2
N$61
  Top 0.152: DRIVER6.6 65.72,42.86 94.3,42.86 97.79,46.35 97.79,54.61 DOT11.1
N$62  (via drill 0.35)
  Top 0.152: v59.69,82.23 57.79,84.14 8.26,84.14 3.81,88.58 DOT10.2
  Bottom 0.152: DRIVER5.14 61.28,46.04 61.28,53.97 61.91,54.61 61.91,73.03 59.69,75.25 v59.69,82.23
N$63  (via drill 0.35)
  Top 0.152: v69.85,45.72 70.8,46.67 96.52,46.67 DOT12.2
  Bottom 0.152: DRIVER6.14 69.85,34.29 v69.85,45.72
N$64
  Top 0.152: DRIVER6.11 65.09,31.43 80.96,31.43 91.44,41.91 DOT12.1
N$65
  Top 0.152: DRIVER7.3 42.23,51.75 33.02,51.75 32.07,50.8 3.81,50.8 DOT13.2
N$66
  Top 0.152: DRIVER7.6 39.69,54.93 33.02,54.93 32.07,55.88 DOT13.1
N$67  (via drill 0.35)
  Top 0.152: DRIVER7.14 34.93,50.16 v33.34,50.16 | v33.02,41.91 32.7,42.23 20.32,42.23 19.37,43.18 8.57,43.18 3.81,38.42 DOT14.2
  Bottom 0.152: v33.34,50.16 33.02,49.85 v33.02,41.91
N$68  (via drill 0.35)
  Top 0.152: DRIVER7.11 20,58.42 19.37,59.05 v10.79,59.05
  Bottom 0.152: v10.79,59.05 5.08,53.34 5.08,44.45 DOT14.1
N$69  (via drill 0.35)
  Top 0.152: v43.82,24.45 42.86,23.5 35.88,23.5 35.24,24.13 5.08,24.13 3.81,25.4 DOT15.2
  Bottom 0.152: DRIVER8.3 47.31,39.69 47.31,29.84 46.99,29.53 46.99,27.62 v43.82,24.45
N$70
  Top 0.152: DRIVER8.6 39.05,39.05 25.72,39.05 21.91,35.24 15.24,35.24 11.75,31.75 5.08,31.75 DOT15.1
N$71
  Top 0.152: DRIVER8.14 50.16,31.11 93.66,31.11 96.52,33.97 DOT16.2
N$72
  Top 0.152: DRIVER8.11 42.86,30.8 94.93,30.8 DOT16.1
N$73
  Bottom 0.152: SR6.14 13.33,22.23 13.33,79.38 SR5.9
N$75  (via drill 0.35)
  Top 0.152: v73.03,10.16 69.22,6.35 17.15,6.35 v17.15,12.07 | v13.97,65.41 11.43,65.41 SR5.15
  Bottom 0.152: DRIVER9.2 73.03,19.68 v73.03,10.16 | v17.15,12.07 13.97,15.24 v13.97,65.41
N$76  (via drill 0.35)
  Top 0.152: v68.9,16.19 68.58,16.51 v25.72,16.51
  Bottom 0.152: DRIVER9.7 68.9,14.29 v68.9,16.19 | v25.72,16.51 20.95,21.27 20.95,61.59 SR5.1
N$77  (via drill 0.35)
  Top 0.152: DRIVER9.10 73.98,11.75 60.33,11.75 58.42,13.65 v17.15,13.65
  Bottom 0.152: v17.15,13.65 17.15,68.26 18.73,69.85 20.32,69.85 20.32,67.31 SR5.2
N$78  (via drill 0.35)
  Top 0.152: DRIVER9.15 73.98,26.35 65.09,26.35 64.14,25.4 36.51,25.4 35.56,26.35 22.23,26.35 19.37,29.21 v18.41,29.21
  Bottom 0.152: v18.41,29.21 17.46,30.16 17.46,66.99 SR5.3
N$79
  Top 0.152: DRIVER10.2 37.78,79.69 37.78,70.8 23.18,70.8 22.23,69.85 20.32,69.85 SR5.4
N$80
  Bottom 0.152: SR5.5 DRIVER10.7
N$81
  Top 0.152: DRIVER10.10 24.13,76.2 SR5.6
N$82
  Top 0.152: DRIVER10.15 39.37,79.69 40.01,79.69 40.32,80.01 40.32,82.87 36.2,82.87 35.24,81.92 35.24,78.74 SR5.7
N$85
  Bottom 0.152: DRIVER11.2 76.52,23.18 76.52,6.03 72.39,1.9 11.11,1.9 11.11,13.34 12.7,14.92 12.7,16.51 SR6.15
N$86
  Top 0.152: DRIVER11.7 77.79,13.65 59.06,13.65 58.74,13.97 20.32,13.97 SR6.1
N$87
  Top 0.152: DRIVER11.10 85.09,13.97 59.37,13.97 59.06,14.29 22.54,14.29 SR6.2
N$88
  Top 0.152: DRIVER11.15 85.41,24.45 65.72,24.45 63.82,22.54 59.06,22.54 58.42,23.18 36.83,23.18 34.93,21.27 20,21.27 SR6.3
N$89  (via drill 0.35)
  Top 0.152: DRIVER12.2 53.98,17.14 37.15,17.14 34.93,19.37 v20.64,19.37
  Bottom 0.152: v20.64,19.37 20.32,19.68 20.32,21.59 SR6.4
N$90  (via drill 0.35)
  Top 0.152: v41.91,24.13 41.59,24.45 20,24.45 SR6.5
  Bottom 0.152: DRIVER12.7 41.91,20.32 v41.91,24.13
N$91
  Bottom 0.152: DRIVER12.10 41.91,10.16 41.91,9.53 34.93,2.54 15.24,2.54 15.24,7.3 17.78,9.84 17.78,26.67 SR6.6
N$92  (via drill 0.35)
  Top 0.152: DRIVER12.15 54.29,9.84 v25.08,9.84
  Bottom 0.152: v25.08,9.84 21.27,13.65 21.27,20.32 20.64,20.96 20.64,28.89 SR6.7
N$93
  Top 0.152: DRIVER9.11 75.56,14.61 77.15,14.61 77.47,14.29 87,14.29 96.52,4.76 DOT18.1
N$94
  Bottom 0.152: DRIVER9.3 72.07,18.1 72.07,3.81 DOT17.2
N$95
  Bottom 0.152: DRIVER9.6 65.72,13.65 65.72,5.4 DOT17.1
N$96
  Bottom 0.152: DRIVER10.3 37.78,80.33 37.78,69.85 38.73,68.9 38.73,59.05 37.15,57.47 37.15,44.45 28.58,35.88 28.58,10.79 21.59,3.81 DOT19.2
N$97
  Bottom 0.152: DRIVER10.6 27.94,80.01 27.94,31.43 28.26,31.11 28.26,12.07 21.27,5.08 16.51,5.08 DOT19.1
N$98
  Top 0.152: DRIVER9.14 76.52,21.27 94.3,21.27 97.79,17.78 97.79,8.89 96.52,8.89 DOT18.2
N$99
  Top 0.152: DRIVER10.14 35.24,72.07 22.54,72.07 21.91,72.71 19.69,72.71 19.37,72.39 10.16,72.39 2.22,64.45 2.22,13.02 3.81,13.02 DOT20.2
N$100
  Top 0.152: DRIVER10.11 29.21,77.47 14.29,77.47 11.75,74.93 7.62,74.93 1.59,68.9 1.59,11.43 4.45,11.43 5.08,12.07 5.08,17.78 DOT20.1
N$101
  Top 0.152: DRIVER11.3 80.01,21.59 96.52,21.59 DOT21.2
N$102
  Top 0.152: DRIVER11.6 80.01,16.51 DOT21.1
N$103
  Bottom 0.152: DRIVER11.14 84.77,21.27 84.77,3.81 DOT22.2
N$104
  Bottom 0.152: DRIVER11.11 87.95,13.65 87.95,4.76 85.73,2.54 80.01,2.54 DOT22.1
N$105
  Bottom 0.152: DRIVER12.3 54.29,18.1 54.29,8.89 59.37,3.81 DOT23.2
N$106
  Bottom 0.152: DRIVER12.6 46.67,18.1 46.67,5.4 45.4,4.13 45.4,3.49 46.36,2.54 54.61,2.54 DOT23.1
N$107
  Bottom 0.152: DRIVER12.14 46.99,5.08 46.99,3.81 DOT24.2
N$108
  Bottom 0.152: DRIVER12.11 44.45,10.16 44.45,6.35 DOT24.1
N$109  (via drill 0.35)
  Top 0.152: SR7.9 10.79,56.51 v9.53,56.51
  Bottom 0.152: v9.53,56.51 5.4,52.39 5.4,5.4 RCK.1
N$111  (via drill 0.35)
  Top 0.152: v33.66,5.71 16.51,5.71 v16.51,17.78 | SR7.15 v14.6,41.91
  Bottom 0.152: DRIVER13.2 36.2,13.34 36.2,5.71 v33.66,5.71 | v16.51,17.78 16.51,41.91 v14.6,41.91
N$112  (via drill 0.35)
  Top 0.152: DRIVER13.7 27.62,34.61 v20.32,34.61
  Bottom 0.152: v20.32,34.61 19.05,35.88 SR7.1
N$130
  Bottom 0.152: DRIVER13.3 32.7,16.19 32.7,5.08 33.97,3.81 DOT25.2
N$131
  Bottom 0.152: DRIVER13.6 29.21,20.32 DOT25.1
N$145
  Bottom 0.152: SR3.14 46.99,30.48 46.99,42.23 48.26,43.5 48.26,57.47 48.58,57.78 48.58,74.61 SR2.9
N$146
  Top 0.152: SR5.14 7.62,64.77 3.18,64.77 2.54,64.14 2.54,61.91 23.81,61.91 SR4.9
N$147  (via drill 0.35)
  Top 0.152: v8.26,36.2 SR6.9 | v8.26,43.81 8.89,44.45 SR7.14
  Bottom 0.152: v8.26,43.81 v8.26,36.2
RCK  (via drill 0.35)
  Top 0.152: SR4.12 22.86,53.34 4.45,53.34 2.54,51.43 2.54,49.53 SR7.12 | v24.45,69.22 25.72,70.48 37.15,70.48 39.05,68.58 SR2.12 48.58,68.58 v49.21,67.95 | SR1.12 77.47,45.72 70.8,45.72 70.17,45.08 67.31,45.08 64.45,47.94 v48.9,47.94 | SR6.12 9.84,26.99 2.54,26.99 2.54,24.77 3.49,23.81 8.57,23.81 8.57,4.05 RCK.2
  Bottom 0.152: SR6.12 13.02,26.99 13.02,47.94 | SR7.12 13.02,47.94 | SR5.12 13.02,72.07 13.02,47.94 | v24.45,69.22 22.86,67.63 22.86,55.88 SR4.12 | SR3.12 49.21,30.8 49.21,42.54 48.58,43.18 48.58,47.94 | 48.58,47.94 48.58,57.15 49.21,57.78 v49.21,67.95 | 48.58,47.94 v48.9,47.94
SCK  (via drill 0.35)
  Top 0.152: SR4.11 23.18,58.1 19.69,58.1 19.37,58.42 v12.38,58.42 | SR3.11 54.61,30.48 56.2,30.48 | 56.2,30.48 57.15,29.53 57.15,26.99 29.84,26.99 27.62,29.21 21.91,29.21 19.37,31.75 15.24,31.75 SR6.11 | v77.15,30.16 76.84,30.48 56.2,30.48 | SER.1 30.48,92.71 6.98,92.71 4.76,94.93 2.54,94.93 1.91,94.3 1.91,77.15 10.48,77.15 SR5.11
  Bottom 0.152: SR2.11 44.13,73.98 44.13,92.39 41.27,95.25 31.75,95.25 SER.1 | SR6.11 12.7,29.21 12.7,47.31 11.75,48.26 10.16,48.26 10.16,50.8 SR7.11 12.7,53.34 12.7,58.1 | 12.7,58.1 v12.38,58.42 | SR1.11 77.15,43.5 v77.15,30.16 | SR5.11 10.16,74.93 10.16,65.72 11.11,64.77 12.7,64.77 12.7,58.1
SER  (via drill 0.35)
  Top 0.152: v61.91,94.93 61.59,95.25 28.26,95.25 26.99,93.98 SER.2
  Bottom 0.152: SR1.14 82.87,45.4 82.87,46.35 77.47,51.75 77.47,79.38 v61.91,94.93
VCC_1  (via drill 0.35)
  Top 0.61: DRIVER2.9 47.62,79.38 43.82,79.38 DRIVER10.1 | 50.8,69.85 57.15,69.85 DRIVER4.9 60.33,66.67 v67.31,66.67 | 50.8,69.85 SR2.10 DRIVER10.16 | 50.8,69.85 50.8,66.67 48.26,66.67 47.62,67.31 44.45,67.31 C2.1 44.45,66.67 41.27,66.67 40.01,65.41 37.47,65.41 DRIVER7.9 33.66,65.41 24.13,65.41 | VCC5V.2 3.81,63.5 SR5.16 12.06,64.14 17.78,64.14 18.41,64.77 23.49,64.77 24.13,65.41 | 24.13,65.41 26.03,67.31 C4.1 | SR7.16 12.7,40.64 22.23,40.64 C7.1 | C1.1 80.64,40.64 DRIVER6.1 DRIVER6.16 | DRIVER9.9 76.2,8.89 83.82,8.89 | 83.82,8.89 85.09,8.89 DRIVER11.9 | C3.1 63.5,27.3 66.67,27.3 DRIVER9.1 DRIVER9.16 DRIVER11.1 DRIVER11.16 | DRIVER12.1 60.96,21.59 v72.39,21.59 | v83.82,10.16 83.82,8.89 | DRIVER13.16 DRIVER13.1 39.37,12.7 DRIVER12.9 | DRIVER8.9 39.37,29.21 SR3.16 41.91,27.94 54.61,27.94 SR3.10 | 80.01,76.2 DRIVER1.9 | 80.01,76.2 DRIVER4.1 DRIVER4.16 DRIVER3.1 | DRIVER2.1 66.67,87 87,87 88.27,85.73 88.27,76.2 80.01,76.2 | DRIVER3.9 57.79,56.51 52.7,56.51 | 52.7,56.51 48.9,56.51 SR2.16 | DRIVER7.16 DRIVER7.1 45.72,45.72 DRIVER5.9 48.9,46.35 v52.7,46.35 | DRIVER6.9 v55.88,33.02 DRIVER8.16 | DRIVER1.1 89.53,55.24 83.19,55.24 DRIVER1.16 DRIVER3.16 74.3,53.97 66.67,53.97 DRIVER5.1 | DRIVER8.1 53.98,41.27 56.52,41.27 57.79,42.54 62.86,42.54 DRIVER5.16 | v52.7,55.24 52.7,56.51 | v80.01,45.08 80.64,45.72 87.63,45.72 SR1.16
  Bottom 0.61: DRIVER10.16 DRIVER10.1 | R2.P$2 33.02,85.09 33.02,66.04 DRIVER7.9 | SR6.16 10.16,16.51 10.16,29.21 | SR6.10 10.16,29.21 | 10.16,29.21 10.16,38.1 SR7.16 9.53,41.27 9.53,52.7 SR7.10 | SR5.10 9.53,76.84 9.53,65.41 SR5.16 | SR4.16 22.23,42.54 22.23,40.64 C7.1 | SR4.16 24.13,32.38 22.86,31.11 C6.1 | 22.86,72.39 21.59,71.12 C5.1 | 22.86,72.39 DRIVER10.9 | 25.4,60.96 26.03,61.59 26.03,67.31 | 25.4,60.96 SR4.10 | 26.03,67.31 C4.1 26.03,67.31 | 22.86,72.39 26.03,69.22 26.03,67.31 | SR4.16 25.4,45.72 25.4,60.96 | SR1.10 76.2,41.91 DRIVER6.1 | DRIVER12.1 DRIVER12.16 | DRIVER6.16 74.93,31.75 DRIVER9.16 73.03,26.04 73.03,22.23 v72.39,21.59 | v83.82,10.16 83.82,25.4 DRIVER11.16 | DRIVER12.9 39.37,12.7 39.37,27.94 SR3.16 | DRIVER2.1 DRIVER2.16 67.31,78.74 v67.31,66.67 | DRIVER8.16 DRIVER8.1 53.34,45.72 | DRIVER5.1 DRIVER5.16 | SR1.16 90.17,45.72 DRIVER1.1 | DRIVER3.16 DRIVER3.1 | 53.34,45.72 v52.7,46.35 | v52.7,55.24 53.34,54.61 53.34,45.72 | v55.88,33.02 SR3.10 | v80.01,45.08 80.01,41.27 80.64,40.64 C1.1
VCC_2  (via drill 0.35)
  Top 0.61: DRIVER2.8 46.67,89.22 16.83,89.22 R1.P$2 | v37.15,22.54 DRIVER12.8 | DRIVER9.8 66.36,9.21 v40.32,9.21 | DRIVER11.8 80.01,11.43 87.63,11.43 88.27,10.79 88.27,7.62 v71.44,7.62 | DRIVER6.8 52.7,34.92 34.93,34.92 34.29,34.29 DRIVER13.8 | v16.51,61.28 16.83,60.96 33.02,60.96 34.29,62.23 41.91,62.23 DRIVER7.8
  Bottom 0.61: DRIVER10.8 17.78,87.63 R1.P$2 15.24,83.82 | 15.24,83.82 3.81,83.82 1.91,81.92 1.91,77.79 3.49,76.2 VCCMOTOR.2 | DRIVER6.8 58.42,53.34 57.15,54.61 57.15,62.23 57.31,62.39 | DRIVER3.8 57.31,62.39 | DRIVER4.8 57.15,74.93 57.15,62.55 57.31,62.39 | DRIVER5.8 45.72,53.34 45.72,60.96 DRIVER7.8 43.18,63.18 39.37,63.18 39.37,45.72 38.73,45.08 38.73,42.54 39.37,41.91 39.37,31.75 36.2,28.57 | DRIVER8.8 34.29,39.37 DRIVER13.8 36.2,28.57 | 36.2,28.57 36.2,23.5 v37.15,22.54 37.15,12.38 v40.32,9.21 | v71.44,7.62 67.31,7.62 DRIVER9.8 | DRIVER1.8 94.61,78.11 94.61,85.41 95.89,86.68 98.11,86.68 98.11,40.64 86.68,29.21 81.6,29.21 81.6,13.02 DRIVER11.8 | 15.24,83.82 16.51,82.55 v16.51,61.28
(copper drawn outside any net)
  shapes: Top area x2